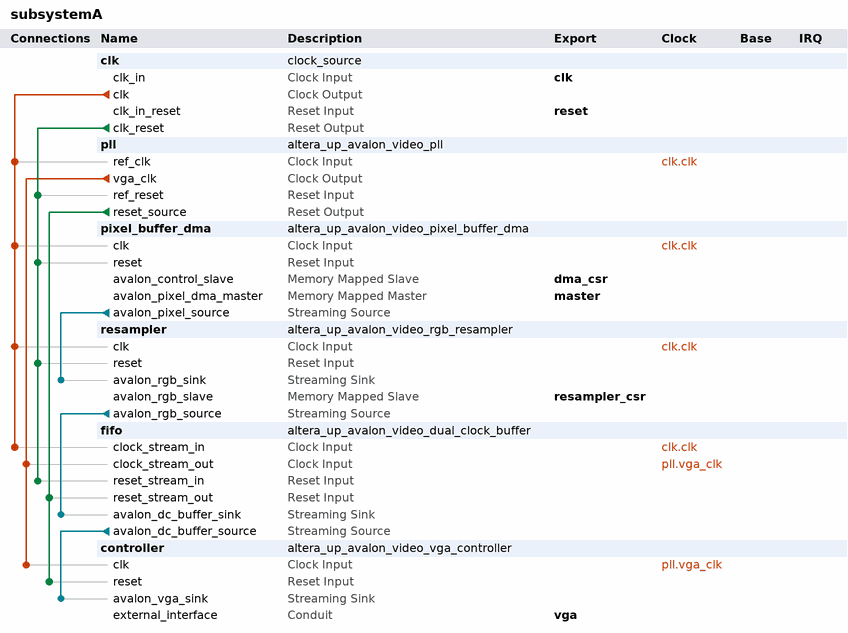
[diagram p0: system contents]
# Platform Designer (Qsys) system subsystemA, Cyclone V 5CSEMA5F31C6
# Parameters at their usual value, and those the tool derives, are not listed.
package require -exact qsys 18.0
create_system subsystemA
set_project_property DEVICE_FAMILY {Cyclone V}
set_project_property DEVICE 5CSEMA5F31C6

add_instance clk clock_source 24.1
set_instance_parameter_value clk clockFrequency 50000000

add_instance pll altera_up_avalon_video_pll 18.0
set_instance_parameter_value pll camera {5MP Digital Camera (THDB_D5M)}
set_instance_parameter_value pll gui_refclk 50.0
set_instance_parameter_value pll lcd {7" LCD on VEEK-MT and MTL/MTL2 Modules}

add_instance pixel_buffer_dma altera_up_avalon_video_pixel_buffer_dma 18.0
set_instance_parameter_value pixel_buffer_dma addr_mode Consecutive
set_instance_parameter_value pixel_buffer_dma back_start_address 1023410176
set_instance_parameter_value pixel_buffer_dma color_space {24-bit RGB}
set_instance_parameter_value pixel_buffer_dma image_height 480
set_instance_parameter_value pixel_buffer_dma image_width 640
set_instance_parameter_value pixel_buffer_dma start_address 1006632960

add_instance resampler altera_up_avalon_video_rgb_resampler 18.0
set_instance_parameter_value resampler alpha 1023
set_instance_parameter_value resampler input_type {24-bit RGB}
set_instance_parameter_value resampler output_type {30-bit RGB}

add_instance fifo altera_up_avalon_video_dual_clock_buffer 18.0
set_instance_parameter_value fifo color_bits 10

add_instance controller altera_up_avalon_video_vga_controller 18.0
set_instance_parameter_value controller board DE1-SoC
set_instance_parameter_value controller resolution {VGA 640x480}

# connections
add_connection clk.clk fifo.clock_stream_in clock
add_connection clk.clk pixel_buffer_dma.clk clock
add_connection clk.clk pll.ref_clk clock
add_connection clk.clk resampler.clk clock
add_connection pll.vga_clk controller.clk clock
add_connection pll.vga_clk fifo.clock_stream_out clock
add_connection clk.clk_reset fifo.reset_stream_in reset
add_connection clk.clk_reset pixel_buffer_dma.reset reset
add_connection clk.clk_reset pll.ref_reset reset
add_connection clk.clk_reset resampler.reset reset
add_connection pll.reset_source controller.reset reset
add_connection pll.reset_source fifo.reset_stream_out reset
add_connection fifo.avalon_dc_buffer_source controller.avalon_vga_sink avalon_streaming
add_connection pixel_buffer_dma.avalon_pixel_source resampler.avalon_rgb_sink avalon_streaming
add_connection resampler.avalon_rgb_source fifo.avalon_dc_buffer_sink avalon_streaming

# exported interfaces
add_interface clk clock sink
set_interface_property clk EXPORT_OF clk.clk_in
add_interface dma_csr avalon slave
set_interface_property dma_csr EXPORT_OF pixel_buffer_dma.avalon_control_slave
add_interface master avalon master
set_interface_property master EXPORT_OF pixel_buffer_dma.avalon_pixel_dma_master
add_interface resampler_csr avalon slave
set_interface_property resampler_csr EXPORT_OF resampler.avalon_rgb_slave
add_interface reset reset sink
set_interface_property reset EXPORT_OF clk.clk_in_reset
add_interface vga conduit end
set_interface_property vga EXPORT_OF controller.external_interface

set_interconnect_requirement {$system} qsys_mm.clockCrossingAdapter AUTO
set_interconnect_requirement {$system} qsys_mm.enableEccProtection FALSE
set_interconnect_requirement {$system} qsys_mm.insertDefaultSlave FALSE
set_interconnect_requirement {$system} qsys_mm.maxAdditionalLatency 1

save_system subsystemA.qsys
